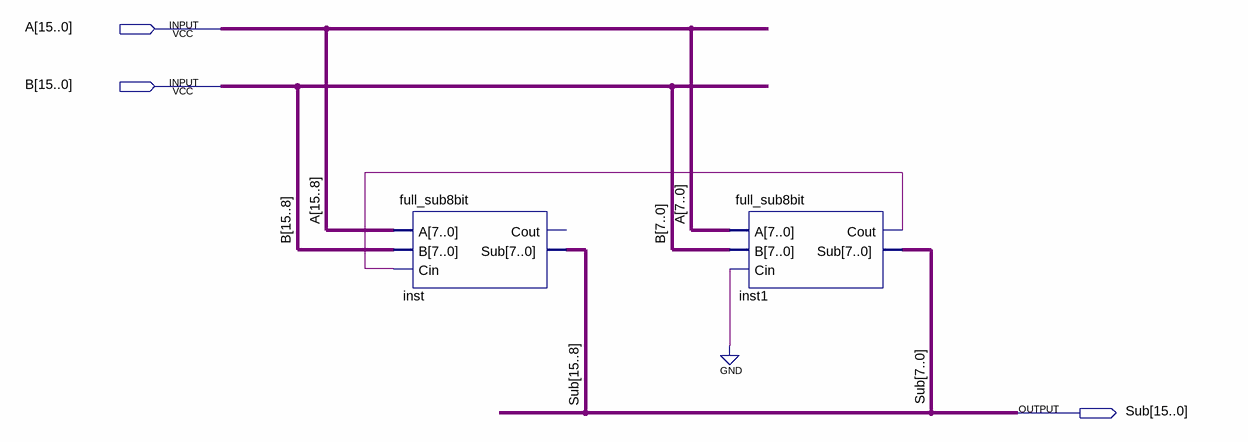
[diagram p0: schematic sheet]
// Quartus schematic full_sub16bit.bdf as structural Verilog: 2 symbols, 3 pins
module full_sub16bit (
  input  [15:0] A,
  input  [15:0] B,
  output [15:0] Sub
);

  wire inst1_cout;

  full_sub8bit inst (.A(A[15:8]), .B(B[15:8]), .Cin(inst1_cout), .Sub(Sub[15:8]));  // open: Cout
  full_sub8bit inst1 (.A(A[7:0]), .B(B[7:0]), .Cin(1'b0), .Cout(inst1_cout), .Sub(Sub[7:0]));
endmodule
